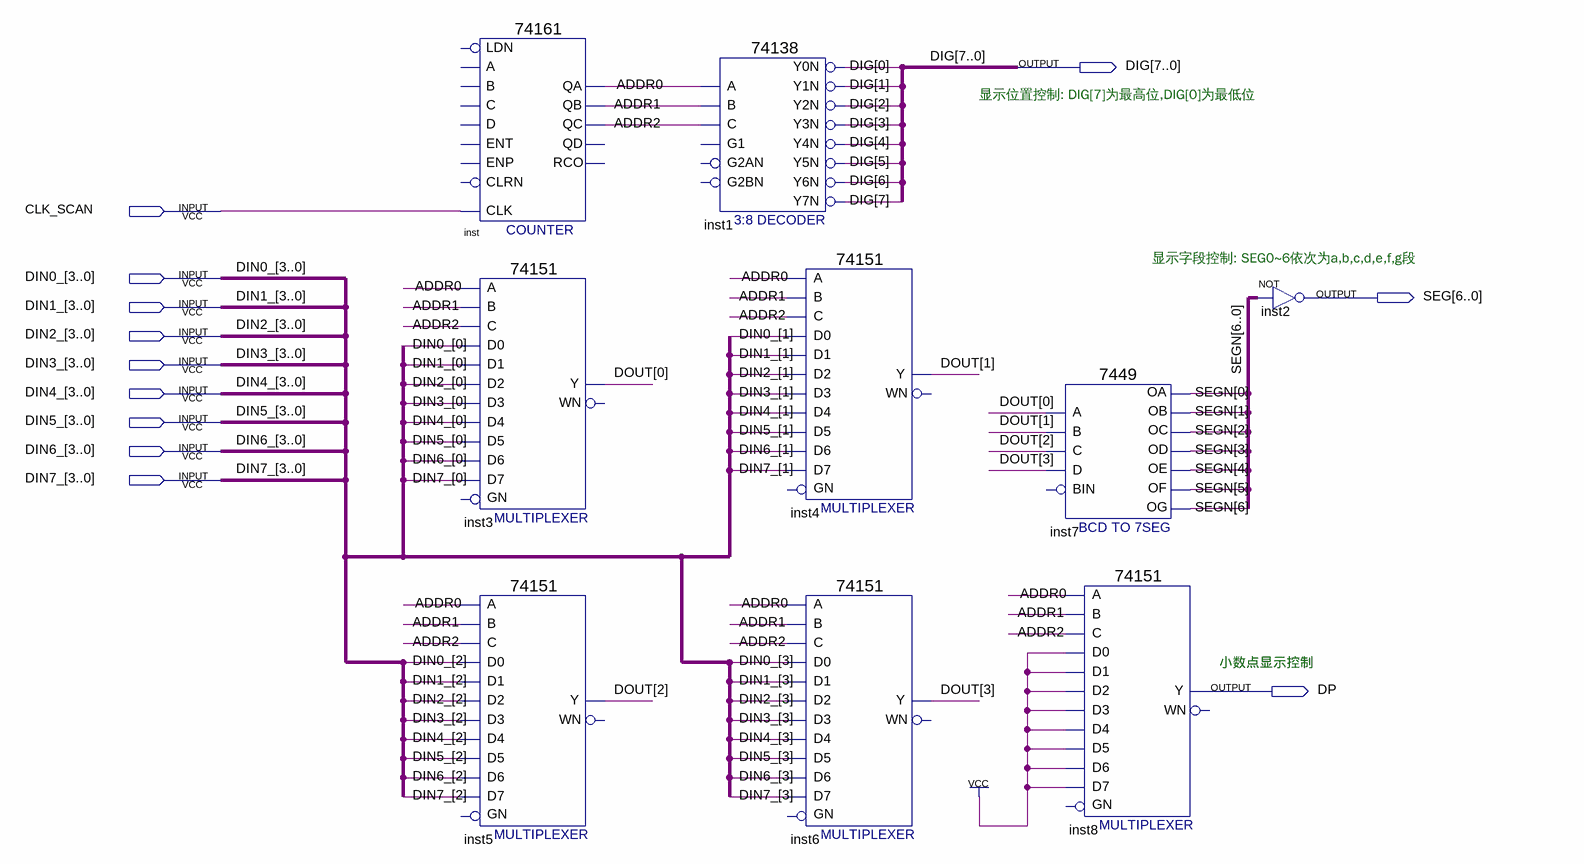
[diagram p0: schematic sheet]
// Quartus schematic ScanDisplay.bdf as structural Verilog: 9 symbols, 12 pins
module ScanDisplay (
  input  CLK_SCAN,
  input  [3:0] DIN0_,
  input  [3:0] DIN1_,
  input  [3:0] DIN2_,
  input  [3:0] DIN3_,
  input  [3:0] DIN4_,
  input  [3:0] DIN5_,
  input  [3:0] DIN6_,
  input  [3:0] DIN7_,
  output [7:0] DIG,
  output [6:0] SEG,
  output DP
);

  wire ADDR0, ADDR1, ADDR2;
  wire [3:0] DOUT;
  wire [6:0] SEGN;

  \74161  inst (.CLK(CLK_SCAN), .QC(ADDR2), .QB(ADDR1), .QA(ADDR0));  // open: CLRN, ENP, LDN, A, D, ENT, B, C, QD, RCO
  \74151  inst3 (
    .C(ADDR2), .B(ADDR1), .A(ADDR0), .D5(DIN5_[0]), .D0(DIN0_[0]), .D1(DIN1_[0]), .D4(DIN4_[0]),
    .D3(DIN3_[0]), .D2(DIN2_[0]), .D6(DIN6_[0]), .D7(DIN7_[0]), .Y(DOUT[0]));  // open: GN, WN
  \74151  inst5 (
    .C(ADDR2), .B(ADDR1), .A(ADDR0), .D5(DIN5_[2]), .D0(DIN0_[2]), .D1(DIN1_[2]), .D4(DIN4_[2]),
    .D3(DIN3_[2]), .D2(DIN2_[2]), .D6(DIN6_[2]), .D7(DIN7_[2]), .Y(DOUT[2]));  // open: GN, WN
  \74138  inst1 (
    .A(ADDR0), .B(ADDR1), .C(ADDR2), .Y0N(DIG[0]), .Y1N(DIG[1]), .Y2N(DIG[2]), .Y3N(DIG[3]), .Y4N(DIG[4]),
    .Y5N(DIG[5]), .Y6N(DIG[6]), .Y7N(DIG[7]));  // open: G1, G2AN, G2BN
  \74151  inst4 (
    .C(ADDR2), .B(ADDR1), .A(ADDR0), .D5(DIN5_[1]), .D0(DIN0_[1]), .D1(DIN1_[1]), .D4(DIN4_[1]),
    .D3(DIN3_[1]), .D2(DIN2_[1]), .D6(DIN6_[1]), .D7(DIN7_[1]), .Y(DOUT[1]));  // open: GN, WN
  \74151  inst6 (
    .C(ADDR2), .B(ADDR1), .A(ADDR0), .D5(DIN5_[3]), .D0(DIN0_[3]), .D1(DIN1_[3]), .D4(DIN4_[3]),
    .D3(DIN3_[3]), .D2(DIN2_[3]), .D6(DIN6_[3]), .D7(DIN7_[3]), .Y(DOUT[3]));  // open: GN, WN
  \7449  inst7 (
    .A(DOUT[0]), .C(DOUT[2]), .B(DOUT[1]), .D(DOUT[3]), .OC(SEGN[2]), .OD(SEGN[3]), .OF(SEGN[5]),
    .OG(SEGN[6]), .OB(SEGN[1]), .OA(SEGN[0]), .OE(SEGN[4]));  // open: BIN
  \74151  inst8 (
    .C(ADDR2), .B(ADDR1), .A(ADDR0), .D5(1'b1), .D0(1'b1), .D1(1'b1), .D4(1'b1), .D3(1'b1), .D2(1'b1),
    .D6(1'b1), .D7(1'b1), .Y(DP));  // open: GN, WN
  assign SEG = ~SEGN;  // NOT inst2, 7 bits wide

  // Notes on the sheet:
  //   显示位置控制: DIG[7]为最高位,DIG[0]为最低位
  //   显示字段控制: SEG0~6依次为a,b,c,d,e,f,g段
  //   小数点显示控制
endmodule
